# Altium schematic sheet ATmega328P.SchDoc
size 457 x 241 mm; SheetNumber: 4; SheetTotal: 5
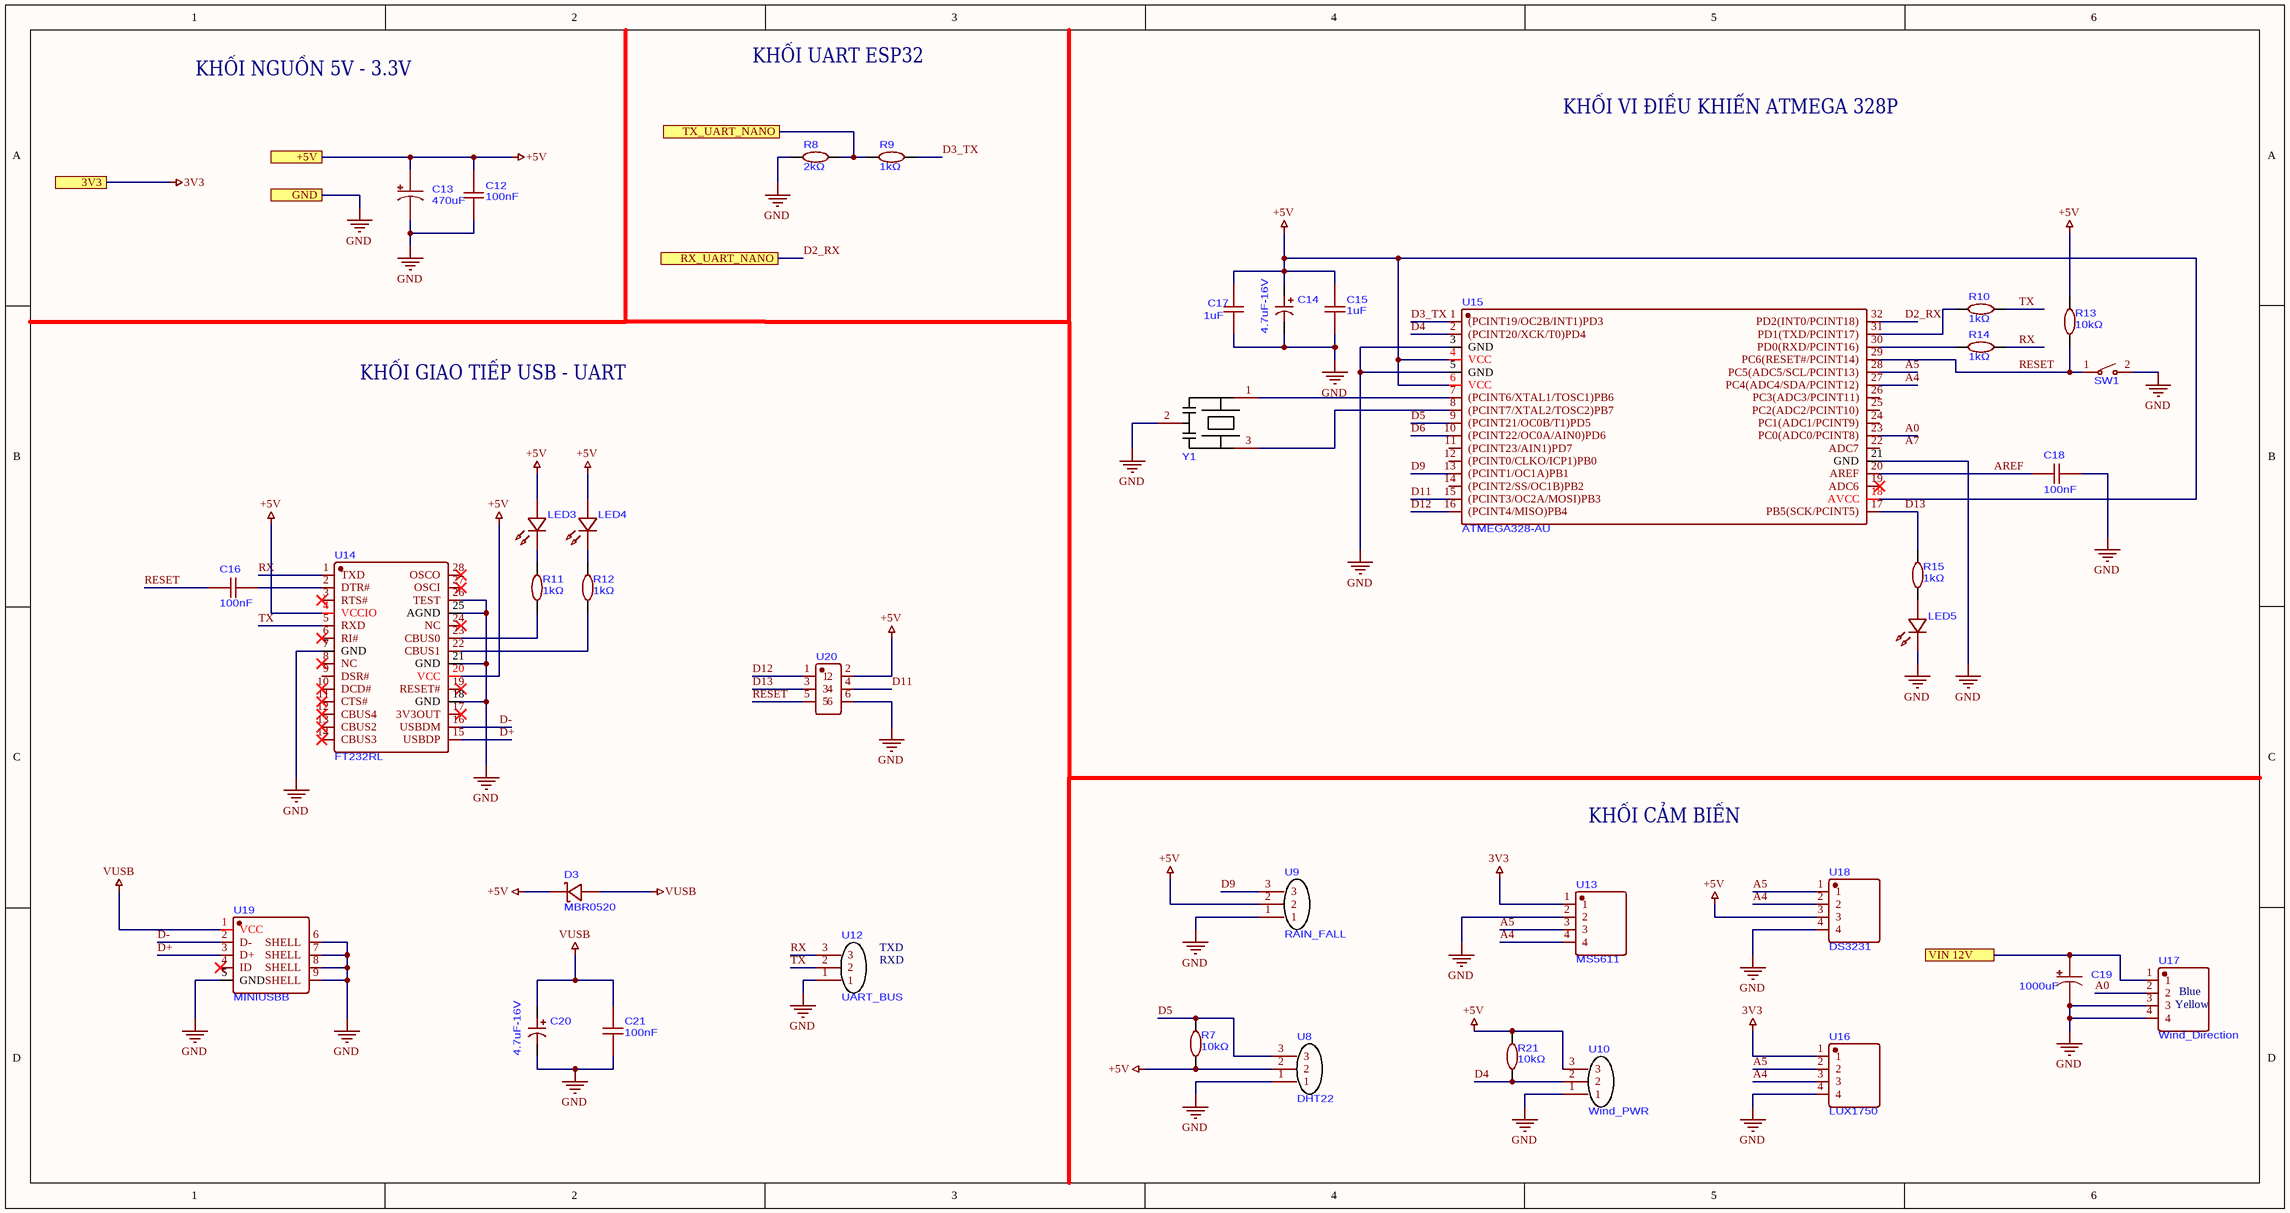
[diagram p0: ATmega328P.SchDoc]

## Parts
C12  100nF  [C0805]
C13  470uF  [CAP-SMD_BD10.0-L10.3-W10.3-LS11.0-R-RD]
C14  4.7uF-16V  [CAP-SMD_L6.0-W3.2-FD]
C15  1uF  [C0805]
C16  100nF  [C0805]
C17  1uF  [C0805]
C18  100nF  [C0805]
C19  1000uF  [CAP-SMD_BD10.0-L10.3-W10.3-LS11.0-R-RD]
C20  4.7uF-16V  [CAP-SMD_L6.0-W3.2-FD]
C21  100nF  [C0805]
D3  MBR0520  [SOD-123_L2.8-W1.8-LS3.7-RD]
LED3  XL-2012SURC  [LED0805-RD_RED]  (value not drawn)
LED4  XL-2012SURC  [LED0805-RD_RED]  (value not drawn)
LED5  XL-2012SURC  [LED0805-RD_RED]  (value not drawn)
R7  10kΩ  [R0805]
R8  2kΩ  [R0805]
R9  1kΩ  [R0805]
R10  1kΩ  [R0805]
R11  1kΩ  [R0805]
R12  1kΩ  [R0805]
R13  10kΩ  [R0805]
R14  1kΩ  [R0805]
R15  1kΩ  [R0805]
R21  10kΩ  [R0805]
SW1  TS-1088R-02026  [SW-SMD_L3.9-W3.0-P4.45]  (value not drawn)
U8  DHT22  [CONN-TH_3P-P2.50_A2501WV2-3P]
U9  RAIN_FALL  [CONN-TH_3P-P2.50_A2501WV2-3P]
U10  Wind_PWR  [CONN-TH_3P-P2.50_A2501WV2-3P]
U12  UART_BUS  [CONN-TH_3P-P2.50_A2501WV2-3P]
U13  MS5611  [CONN-TH_B4B-XH-A-LF-SN]
U14  FT232RL  [SSOP-28_L10.2-W5.3-P0.65-LS7.8-BL]
U15  ATMEGA328-AU  [TQFP-32_L7.0-W7.0-P0.80-LS9.0-BL]
U16  LUX1750  [CONN-TH_B4B-XH-A-LF-SN]
U17  Wind_Direction  [CONN-TH_B4B-XH-A-LF-SN]
U18  DS3231  [CONN-TH_B4B-XH-A-LF-SN]
U19  MINIUSBB  [USB-SMD_MINIUSBB]
U20  BX-PZ2.54-2-3PZZ  [HDR-TH_6P-P2.54-V-M-R2-C3-S2.54]  (value not drawn)
Y1  CSTNE16M0V530000R0  [CSTNE16M0V530000R0]  (value not drawn)

## Ports
3V3 (see Merg_project[2B], 12VDC_3V3DC_LM2596[5B], ESP32[1A]), +5V (see Merg_project[2C], 12VDC_5VDC_XL4015[4B], ESP32[1B]), GND (see Merg_project[2C], 12VDC_3V3DC_LM2596[5C], 12VDC_5VDC_XL4015[4C], ESP32[1A]), RX_UART_NANO (see Merg_project[2C]), TX_UART_NANO (see Merg_project[2C]), VIN 12V (see Merg_project[2B], 12VDC_3V3DC_LM2596[2B], 12VDC_5VDC_XL4015[1B])

## Nets
3V3: U13.1 U16.1 ; port 3V3
+5V: C12.2 C13.1 C14.1 C15.1 C17.1 D3.1(K) LED3.2(A) LED4.2(A) R7.2 R13.2 R21.1 U8.2 U9.2 U10.3 U14.4(VCCIO) U14.20(VCC) U15.4(VCC) U15.6(VCC) U15.18(AVCC) U18.3 U20.2 ; port +5V
GND: C12.1 C13.2 C14.2 C15.2 C17.2 C18.2 C19.2 C20.2 C21.1 LED5.1(K) R8.1 SW1.2 U8.1 U9.1 U10.1 U12.1 U13.2 U14.7(GND) U14.18(GND) U14.21(GND) U14.25(AGND) U14.26(TEST) U15.3(GND) U15.5(GND) U15.21(GND) U16.4 U17.3 U17.4 U18.4 U19.5(GND) U19.6(SHELL) U19.7(SHELL) U19.8(SHELL) U19.9(SHELL) U20.6 Y1.2 ; port GND
VUSB: C20.1 C21.2 D3.2(A) U19.1(VCC)
A0: U15.23(PC0(ADC0/PCINT8)) U17.2
A4: U13.4 U15.27(PC4(ADC4/SDA/PCINT12)) U16.3 U18.2
A5: U13.3 U15.28(PC5(ADC5/SCL/PCINT13)) U16.2 U18.1
AREF: C18.1 U15.20(AREF)
D2_RX: U15.32(PD2(INT0/PCINT18)) ; port RX_UART_NANO
D3_TX: R9.2 U15.1((PCINT19/OC2B/INT1)PD3)
D4: R21.2 U10.2 U15.2((PCINT20/XCK/T0)PD4)
D5: R7.1 U8.3 U15.9((PCINT21/OC0B/T1)PD5)
D6: U15.10((PCINT22/OC0A/AIN0)PD6)
D9: U9.3 U15.13((PCINT1/OC1A)PB1)
D11: U15.15((PCINT3/OC2A/MOSI)PB3) U20.4
D12: U15.16((PCINT4/MISO)PB4) U20.1
D13: R15.2 U15.17(PB5(SCK/PCINT5)) U20.3
D+: U14.15(USBDP) U19.3(D+)
D-: U14.16(USBDM) U19.2(D-)
RESET: C16.1 R13.1 SW1.1 U15.29(PC6(RESET#/PCINT14)) U20.5
RX: R14.1 U12.3 U14.1(TXD)
TX: R10.1 U12.2 U14.5(RXD)
TX_UART_NANO: R8.2 R9.1 ; port TX_UART_NANO
VIN 12V: C19.1 U17.1 ; port VIN 12V
NetC16_2: C16.2 U14.2(DTR#)
NetLED3_1: LED3.1(K) R11.2
NetLED4_1: LED4.1(K) R12.2
NetLED5_2: LED5.2(A) R15.1
NetR10_2: R10.2 U15.31(PD1(TXD/PCINT17))
NetR11_1: R11.1 U14.23(CBUS0)
NetR12_1: R12.1 U14.22(CBUS1)
NetR14_2: R14.2 U15.30(PD0(RXD/PCINT16))
NetU15_7: U15.7((PCINT6/XTAL1/TOSC1)PB6) Y1.1
NetU15_8: U15.8((PCINT7/XTAL2/TOSC2)PB7) Y1.3

Not connected (* = marked no-connect by the designer): U14 3(RTS#)* 6(RI#)* 8(NC)* 9(DSR#) 10(DCD#)* 11(CTS#)* 12(CBUS4)* 13(CBUS2)* 14(CBUS3)* 17(3V3OUT)* 19(RESET#)* 24(NC)* 27(OSCI)* 28(OSCO)*; U15 11((PCINT23/AIN1)PD7) 12((PCINT0/CLKO/ICP1)PB0) 14((PCINT2/SS/OC1B)PB2) 19(ADC6)* 22(ADC7) 24(PC1(ADC1/PCINT9)) 25(PC2(ADC2/PCINT10)) 26(PC3(ADC3/PCINT11)); U19 4(ID)*

## Notes on the sheet
- KHỐI NGUỒN 5V - 3.3V
- KHỐI UART ESP32
- KHỐI VI ĐIỀU KHIỂN ATMEGA 328P
- KHỐI GIAO TIẾP USB - UART
- KHỐI CẢM BIẾN
- (near U12) TXD
- (near U12) RXD
- (near U17) Yellow
- (near U17) Blue
- Labels drawn without touching a wire or pin: A7

## Library data of the parts
C12 C16 C18 C21 = CC0805KRX7R9BB104
C13 C19 = VEJ102M1ATR-1010
C14 C20 = TCJC475M063R0200
C15 C17 = TCC0805X7R105K250DTS
R7-R15 R21 = RC0805FR-071KL
U8-U10 U12 = B3B-XH-A(LF)(SN)
U13 U16-U18 = B4B-XH-A(LF)(SN)